# EAGLE design solderstation_v1_6 (EAGLE 6.6.0)
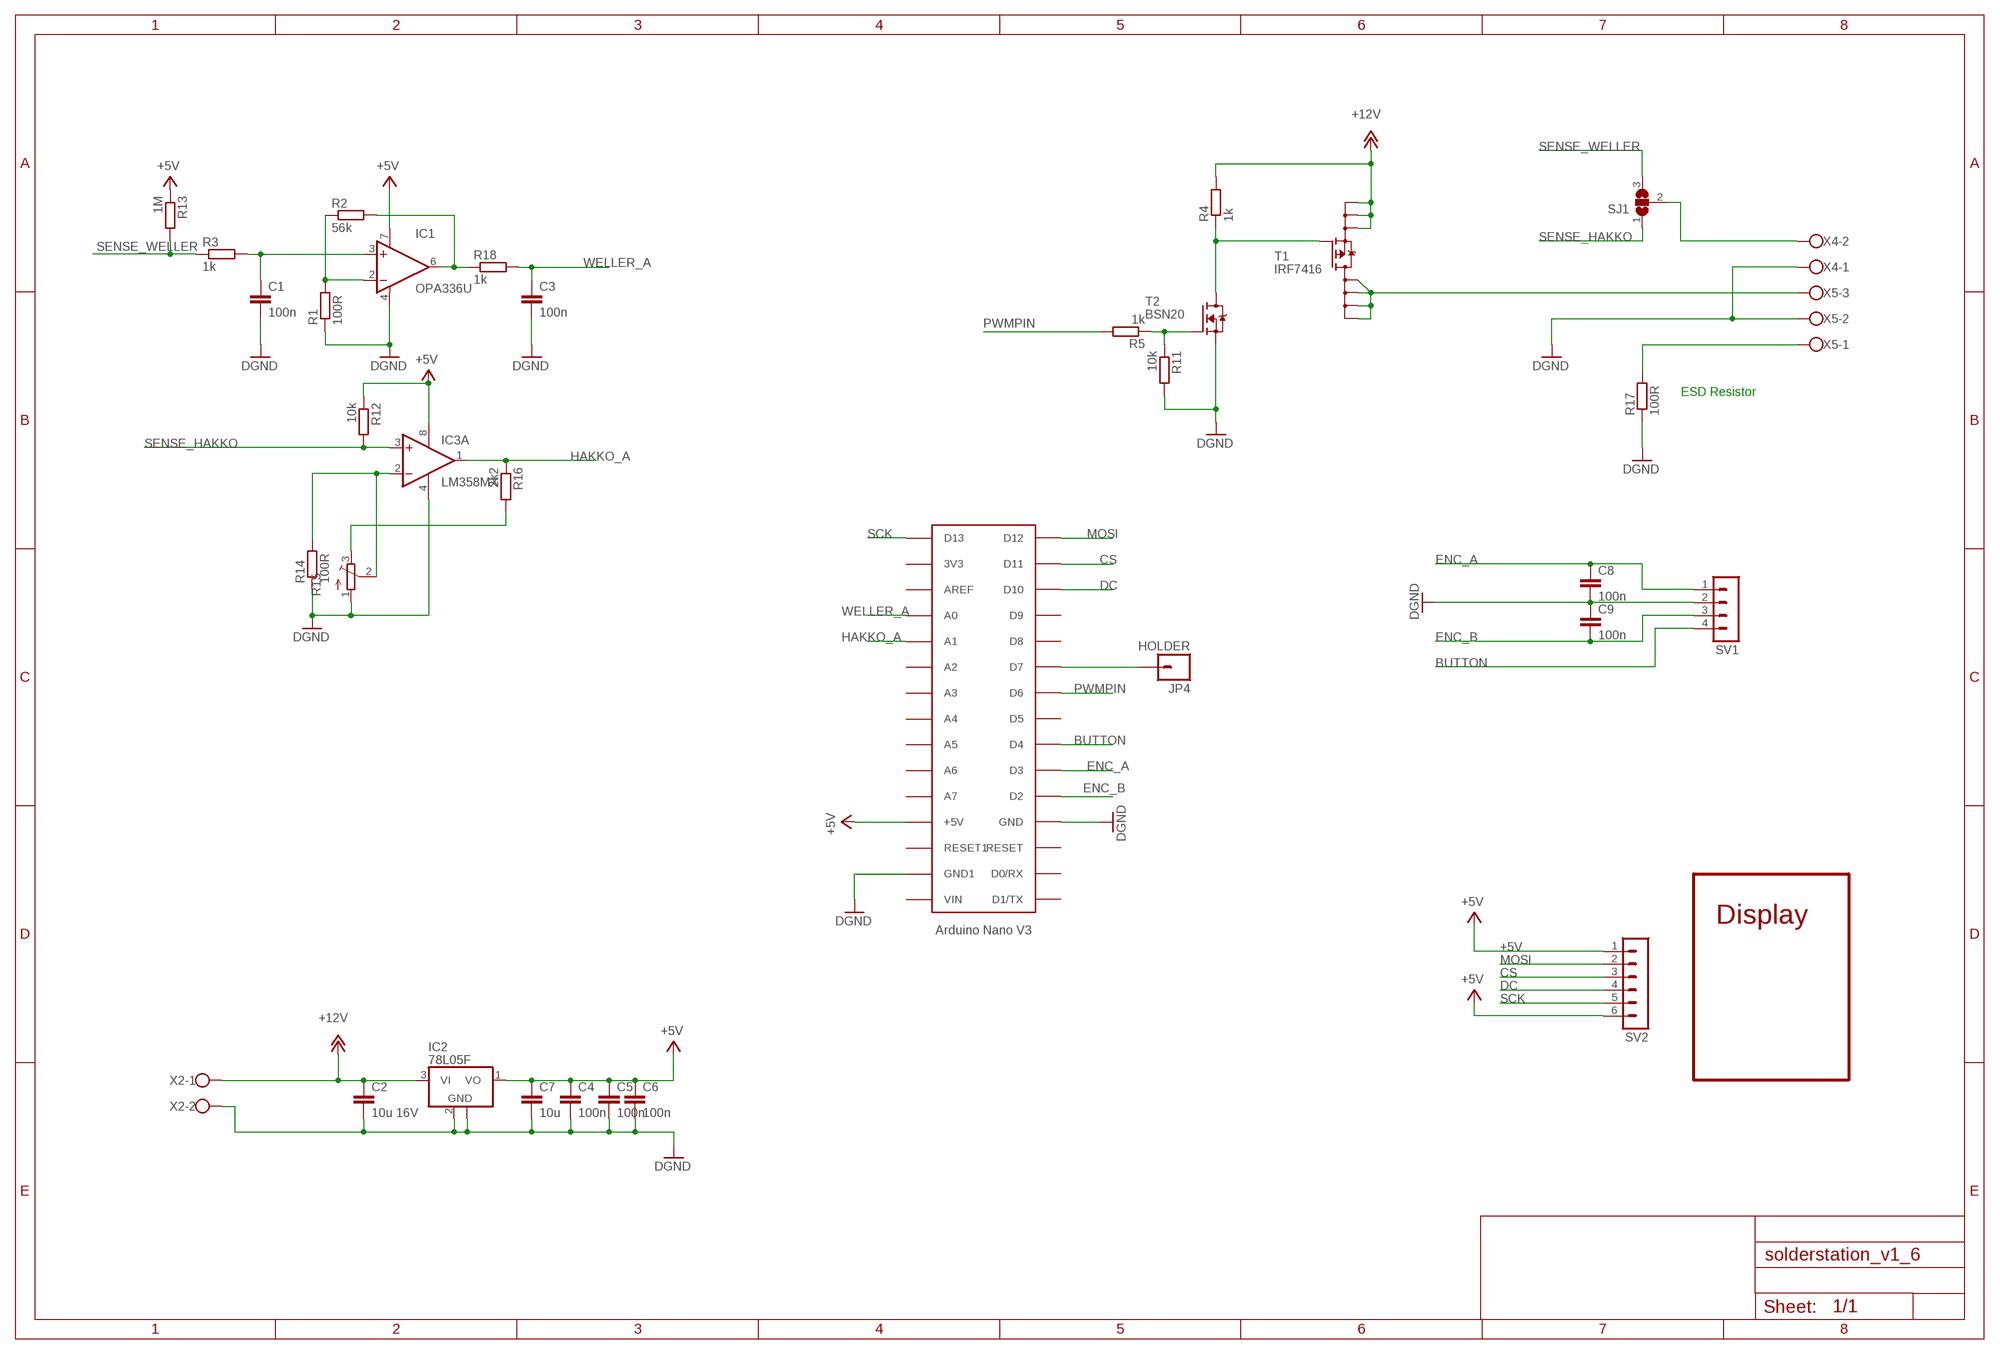
[diagram p0: schematic, sheet 1]

## Parts
C1  100n  C-EUC1206  [C1206]
C2  10u 16V  C-EUC1210K  [C1210K]
C3  100n  C-EUC1206  [C1206]
C4  100n  C-EUC1206  [C1206]
C5  100n  C-EUC1206  [C1206]
C6  100n  C-EUC1206  [C1206]
C7  10u  C-EUC1210K  [C1210K]
C8  100n  C-EUC1206  [C1206]
C9  100n  C-EUC1206  [C1206]
IC1  OPA336U  [SO08]
IC2  78L05F  [SOT89]
IC3  LM358MX  [SO08]
JP4  HOLDER  M01PTH  [1X01]
R1  100R  R-EU_R0603  [R0603]
R2  56k  R-EU_R0603  [R0603]
R3  1k  R-EU_R0603  [R0603]
R4  1k  R-EU_R0603  [R0603]
R5  1k  R-EU_R0603  [R0603]
R11  10k  R-EU_R0603  [R0603]
R12  10k  R-EU_R0603  [R0603]
R13  1M  R-EU_R0603  [R0603]
R14  100R  R-EU_R0603  [R0603]
R15  TRIM_EU-SM-42/43X  [SM-42/43X]
R16  2k2  R-EU_R0603  [R0603]
R17  100R  R-EU_R0603  [R0603]
R18  1k  R-EU_R0603  [R0603]
SJ1  SJ2W  [SJ_2]
SV1  MA04-1  [MA04-1]
SV2  MA06-1  [MA06-1]
T1  IRF7416  [SO8]
T2  BSN20  [SOT23]
U$6  ARDUINONANO  [PDIP-32]
X2  W237-102  [W237-102]
X4  W237-102  [W237-102]
X5  W237-103  [W237-103]

## Nets
+5V: C4.1 C5.1 C6.1 C7.1 IC1.7(V+) IC2.1(VO) IC3.8(P:V+) R12.1 R13.1 SV2.1 SV2.6 U$6.+5V
+12V: C2.1 IC2.3(VI) R4.2 T1.1(S0) T1.2(S1) T1.3(S2) X2.1
BUTTON: SV1.4 U$6.D4
CS: SV2.3 U$6.D11
DC: SV2.4 U$6.D10
DGND: C1.2 C2.2 C3.2 C4.2 C5.2 C6.2 C7.2 C8.2 C9.1 IC1.4(V-) IC2.2(GND) IC2.2@1(GND) IC3.4(P:V-) R1.1 R11.2 R14.1 R15.1(A) R17.1 SV1.2 T2.2(S) U$6.GND U$6.GND1 X2.2 X4.1 X5.2
ENC_A: C8.1 SV1.1 U$6.D3
ENC_B: C9.2 SV1.3 U$6.D2
HAKKO_A: IC3.1(A:OUT) R16.1 U$6.A6(A1)
HEATER: T1.5(D0) T1.6(D1) T1.7(D2) T1.8(D3) X5.3
MOSI: SV2.2 U$6.D12
N$1: IC1.2(-IN) R1.2 R2.1
N$2: IC1.6(OUT) R2.2 R18.1
N$3: R5.1 R11.1 T2.1(G)
N$4: C1.1 IC1.3(+IN) R3.2
N$5: R4.1 T1.4(G) T2.3(D)
N$12: SJ1.2 X4.2
N$14: R15.3(E) R16.2
N$15: IC3.2(A:-IN) R14.2 R15.2(S)
N$16: JP4.1 U$6.D7
N$17: R17.2 X5.1
PWMPIN: R5.2 U$6.D6
SCK: SV2.5 U$6.D13
SENSE_HAKKO: IC3.3(A:+IN) R12.2 SJ1.1
SENSE_WELLER: R3.1 R13.2 SJ1.3
WELLER_A: C3.1 R18.2 U$6.A7(A0)
Unconnected: IC3.5(B:+IN) IC3.6(B:-IN) IC3.7(B:OUT) U$6.3V3 U$6.A0(A7) U$6.A1(A6) U$6.A2(A5) U$6.A3(A4) U$6.A4(A3) U$6.A5(A2) U$6.AREF U$6.D0/RX U$6.D1/TX U$6.D5 U$6.D8 U$6.D9 U$6.RESET U$6.RESET1 U$6.VIN

## Notes on the sheet
- ESD Resistor
- Display

## Library data of the parts
C1-C9 = rcl:C-EU: CAPACITOR, European symbol
IC1 = burr-brown:OPA336: CMOS Operational Amplifiers Single-Supply, MicroPower, MicroAmplifier(TM) Series; MF: TEXAS INSTRUMENT CONNECTORS; MPN: OPA336UA; OC_FARNELL: 1459587; OC_NEWARK: 35C1888
IC2 = linear:78L*: POSITOIV-VOLTAGE REGULATORS Output up to 100 mA Source: http://focus.ti.com/lit/ds/symlink/ua78l05.pdf
IC3 = linear:LM358: OP AMP also LM158; LM258; LM2904 Source: http://cache.national.com/ds/LM/LM158.pdf
JP4 = SparkFun:M01: Header 1 Standard 1-pin 0.1" header. Use with straight break away headers (SKU : PRT-00116), right angle break away headers (PRT-00553), swiss pins (PRT-00743), machine pins (PRT-00117), and female headers (PRT-00115).
R1-R5 R11-R14 R16-R18 = rcl:R-EU_: RESISTOR, European symbol
R15 = pot:TRIM_EU-: POTENTIOMETER
SJ1 = jumper:SJ2W: SMD solder JUMPER
SV1 = con-lstb:MA04-1: PIN HEADER; OC_FARNELL: unknown; OC_NEWARK: unknown
SV2 = con-lstb:MA06-1: PIN HEADER; OC_FARNELL: unknown; OC_NEWARK: unknown
T1 = IRF74xx:IRF7416
T2 = bsn20:BSN20
U$6 = CRE-Lib1:ARDUINONANO: Arduino Nano
X2 X4 = con-wago-500:W237-102: WAGO SCREW CLAMP; MPN: 237-102; OC_FARNELL: unknown; OC_NEWARK: 70K9898
X5 = con-wago-500:W237-103: WAGO SCREW CLAMP; MPN: 237-103; OC_FARNELL: unknown; OC_NEWARK: 18M7116

## Board
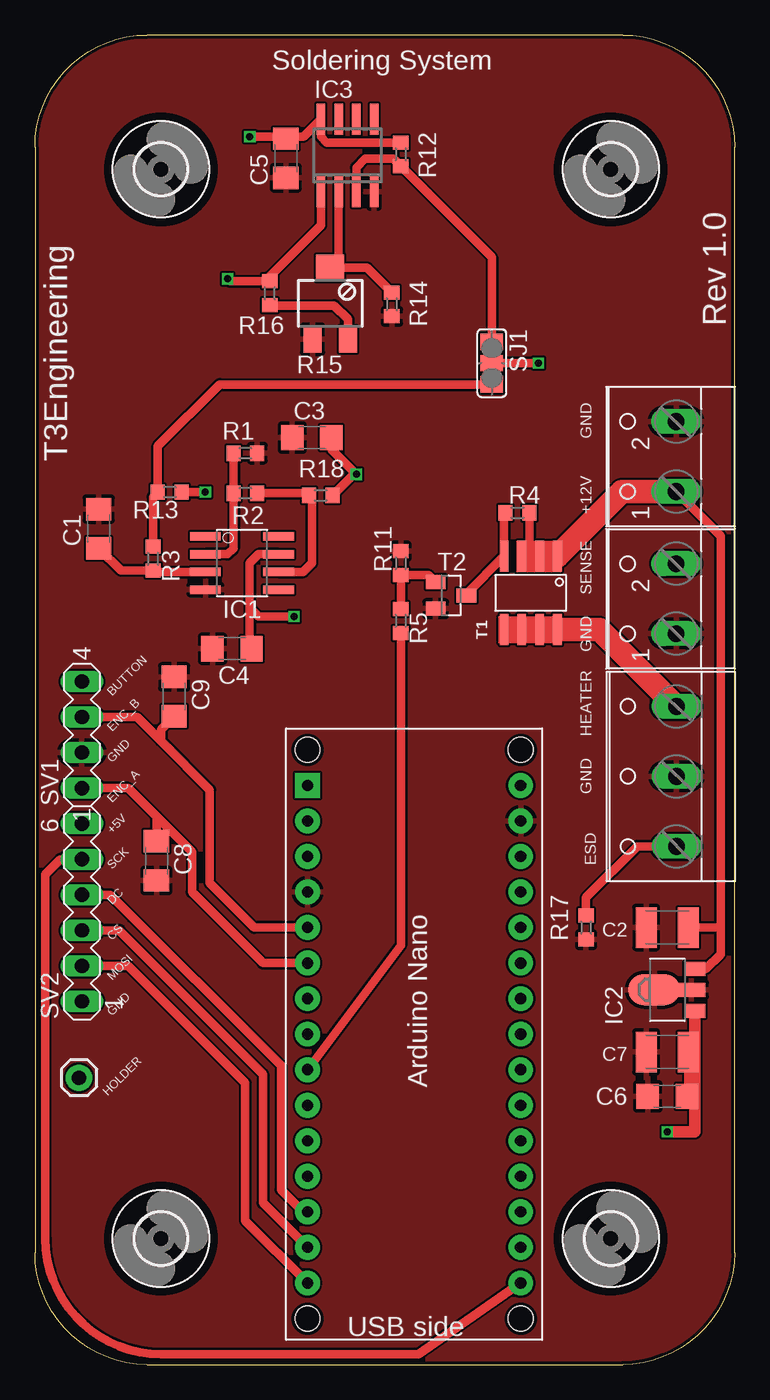
[diagram p1: board, top side]
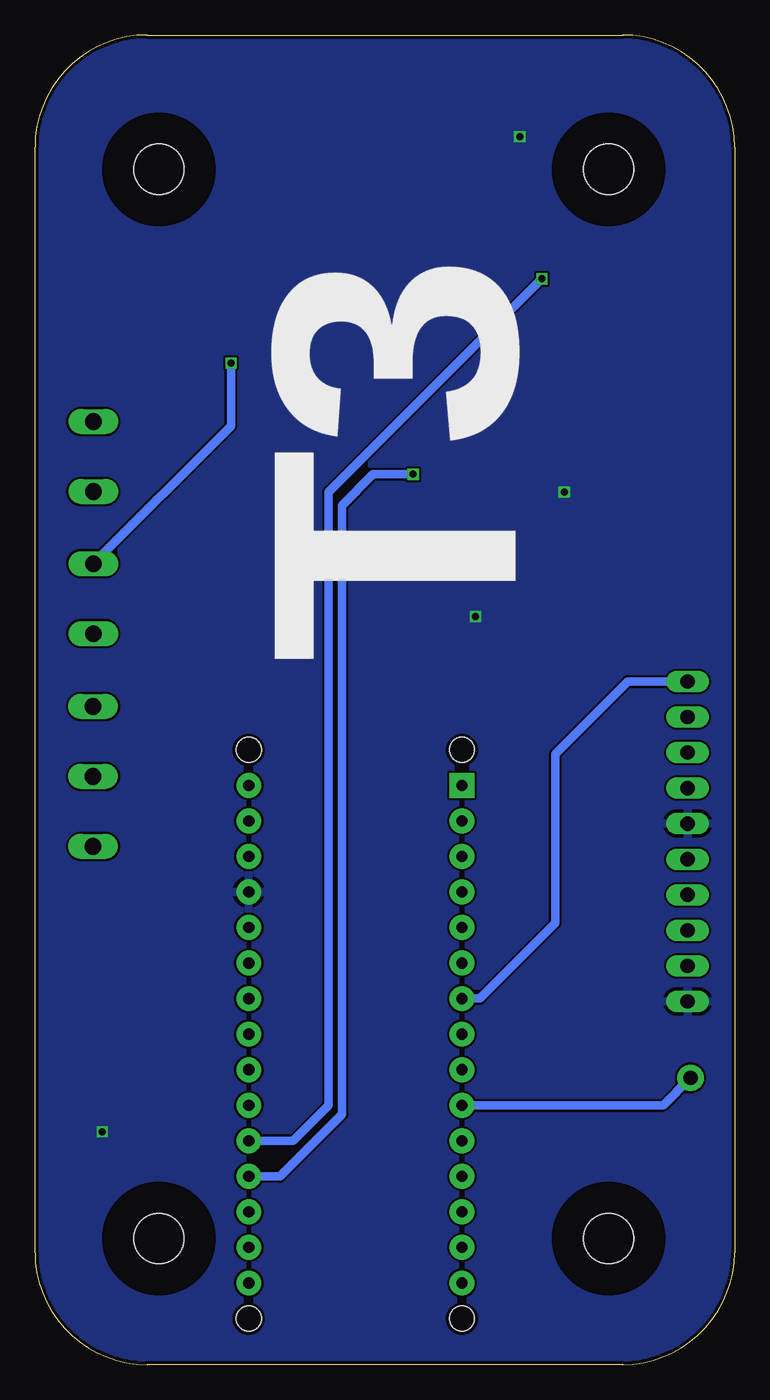
[diagram p2: board, bottom side, seen from below]

Size 50 x 95 mm. Coordinates in mm from the lower left corner, seen from the top.
Outline: 8,0 42,0 arc90 50,8 50,87 arc90 42,95 8,95 arc90 0,87 0,8 arc90 8,0
Copper layers (1*16): Top 0.035mm / dielectric 1.5mm / Bottom 0.035mm
Design rules "SeeedStudio_2layer_DRU_no_angle_20140221": minimum track width 6mil, minimum drill 12mil, track to track 6mil, track to pad 6mil, pad to pad 6mil, via to via 6mil, smd to smd 0mil, copper to edge 10mil, drill to drill 10mil, minimum pad ring 10mil, minimum via ring 6mil, stop-mask expansion 2mil, vias tented up to drill 100mil, thermal gap 10mil

### Footprints (pad centres in the part's own frame; a part is rotated, then mirrored left to right if it is on the bottom)
C1206 = smd 1.6 x 1.8: 1 -1.4,0; 2 1.4,0
C1210K = smd 1.5 x 2.9: 1 -1.5,0; 2 1.5,0
SO08 = smd 0.61 x 2.21: 1 -1.905,-2.616; 2 -0.635,-2.616; 3 0.635,-2.616; 4 1.905,-2.616; 5 1.905,2.616; 6 0.635,2.616; 7 -0.635,2.616; 8 -1.905,2.616
SOT89 = smd 1 x 1.5: 1 -1.499,-1.981; 3 1.499,-1.981 | smd 1 x 2: 2 0,-1.727 | smd 2.2 x 3.7: 2@1 0,0.94
SO08' = smd 0.6 x 2.2: 1 -1.905,-2.6; 2 -0.635,-2.6; 3 0.635,-2.6; 4 1.905,-2.6; 5 1.905,2.6; 6 0.635,2.6; 7 -0.635,2.6; 8 -1.905,2.6
1X01 = drill 1.016 pad 1.88: 1 0,0
R0603 = smd 1 x 1.1: 1 -0.85,0; 2 0.85,0
SM-42/43X = smd 1.3 x 1.9: 1 -1.27,-2.55; 3 1.27,-2.55 | smd 2 x 1.9: 2 0,2.55
SJ_2 = smd 1.168 x 1.6: 1 -1.524,0; 2 0,0; 3 1.524,0
MA04-1 = drill 1.016 long: 1 -3.81,0; 2 -1.27,0; 3 1.27,0; 4 3.81,0
MA06-1 = drill 1.016 long: 1 -6.35,0; 2 -3.81,0; 3 -1.27,0; 4 1.27,0; 5 3.81,0; 6 6.35,0
SO8 = smd 2.21 x 0.61: 1 2.616,-1.905; 2 2.616,-0.635; 3 2.616,0.635; 4 2.616,1.905; 5 -2.616,1.905; 6 -2.616,0.635; 7 -2.616,-0.635; 8 -2.616,-1.905
SOT23 = smd 1 x 1.4: 1 -0.95,-1.1; 2 0.95,-1.1; 3 0,1.1
3,6 = hole 3.6: 0,0
PDIP-32 = drill 0.8 pad 1.778: 3V3 15.24,-35.56; +5V 15.24,-10.16; A0 15.24,-12.7; A1 15.24,-15.24; A2 15.24,-17.78; A3 15.24,-20.32; A4 15.24,-22.86; A5 15.24,-25.4; A6 15.24,-27.94; A7 15.24,-30.48; AREF 15.24,-33.02; D0/RX 0,-5.08; D2 0,-12.7; D3 0,-15.24; D4 0,-17.78; D5 0,-20.32; D6 0,-22.86; D7 0,-25.4; D8 0,-27.94; D9 0,-30.48; D10 0,-33.02; D11 0,-35.56; D12 0,-38.1; D13 15.24,-38.1; GND 0,-10.16; GND1 15.24,-5.08; RESET 0,-7.62; RESET1 15.24,-7.62; VIN 15.24,-2.54 | drill 0.8 pad 1.778 square: D1/TX 0,-2.54 | hole 1.778: 0,0; 0,-40.64; 15.24,-40.64; 15.24,0
W237-102 = drill 1.194 long: 1 -2.5,-1.27; 2 2.5,-1.27
W237-103 = drill 1.194 long: 1 -5,-1.29; 2 0,-1.29; 3 5,-1.29

### Placement (x,y rotation side)
C1  4.56,59.72 90 top
C2  45.2,31.23 180 top
C3  19.79,66.23 180 top
C4  14.09,51.15 180 top
C5  17.93,86.19 270 top
C6  45.2,19.16 180 top
C7  45.2,22.34 180 top
C8  8.68,35.99 270 top
C9  9.95,47.73 270 top
IC1  14.79,57.27 270 top
IC2  45.2,26.78 90 top
IC3  LM358MX  [SO08']  22.34,86.39 0 top
JP4  3.15,20.48 0 top
R1  15.04,65.12 180 top
R2  15.04,62.26 0 top
R3  8.45,57.58 270 top
R4  34.48,60.85 0 top
R5  26.14,53.13 270 top
R11  26.14,57.26 90 top
R12  26.14,86.47 270 top
R13  9.63,62.34 180 top
R14  25.5,75.75 90 top
R15  21.11,75.81 0 top
R16  16.77,76.55 270 top
R17  39.39,31.23 90 top
R18  20.43,62.1 0 top
SJ1  32.65,71.56 270 top
SV1  3.35,44.99 90 top
SV2  3.35,32.3 90 top
T1  35.44,55.14 90 top
T2  29.74,54.95 270 top
U$1  [3,6]  9,9 0 top
U$2  [3,6]  41.15,9 0 top
U$4  [3,6]  9,85.4 0 top
U$5  [3,6]  41.15,85.4 0 top
U$6  19.48,43.92 0 top
X2  44.56,64.88 90 top
X4  44.56,54.72 90 top
X5  44.56,42.02 90 top

### Tracks (layer width: path | path; a pad name or v marks a point on that pad's centre or on a via)
+5V  (via drill 0.5)
  Top 0.61: IC2.1 47.18,22.82 C7.1 46.7,19.26 C6.1 | C5.1 18.42,87.74 | 18.42,87.74 v15.35,87.74 | 15.35,54.09 15.35,57.26 15.99,57.9 IC1.7 | 15.35,54.09 15.98,53.45 v18.52,53.45 | R12.1 20.85,87.32 20.43,87.74 IC3.8 19.18,87.74 18.42,87.74 | R13.1 v12.18,62.34 | 15.35,54.09 15.35,51.28 C4.1
  Top 0.813: IC2.1 47.18,16.62 v45.2,16.62
  pour Bottom: -4.33,97.27 54.72,97.27 54.72,-6.88 -4.33,-6.88
+12V
  Top 0: T1.3 35.35,57.76 T1.2 T1.1
  Top 0.61: IC2.3 47.96,28.28 49.01,29.32 49.01,31.23 | 49.01,31.23 49.01,59.2 X2.1 | C2.1 49.01,31.23 | R4.2 35.33,57.78 35.35,57.76
  Top 1.676: X2.1 41.96,62.38 T1.1
BUTTON
  Bottom 0.61: U$6.D4 18.21,26.14 12.81,31.54 12.81,43.61 7.61,48.8 SV1.4
CS
  Top 0.61: SV2.3 6.03,31.02 16.3,20.75 16.3,11.54 U$6.D11
DC
  Top 0.61: SV2.4 5.39,33.56 17.57,21.38 17.57,12.49 19.16,10.9 U$6.D10
DGND
  pour Top: -1.09,-0.9 -2.9,95.5 51.62,95.5 51.42,-1.1
ENC_A
  Top 0.61: SV1.1 6.66,41.19 8.68,39.16 | 8.68,39.16 11.22,36.62 11.22,33.77 16.3,28.68 U$6.D3 | C8.1 8.68,39.16
ENC_B
  Top 0.61: 9,44.56 12.49,41.07 12.49,34.4 15.67,31.23 U$6.D2 | 9,44.56 7.29,46.27 SV1.3 | C9.2 9,45.38 9,44.56
HAKKO_A  (via drill 0.5)
  Top 0.61: IC3.1 20.43,81.39 16.77,77.73 R16.1 13.95,77.4 v13.76,77.58
  Bottom 0.61: v13.76,77.58 29,62.34 29,18.52 31.54,15.98 U$6.A6
HEATER
  Top 0: T1.5 T1.6 T1.7 T1.8
  Top 1.676: T1.8 40.35,52.52 X5.3
MOSI
  Top 0.61: SV2.2 6.66,28.48 15.03,20.11 15.03,10.27 U$6.D12
N$1
  Top 0.61: IC1.2 13.76,57.9 14.19,58.32 R2.1 R1.2
N$2
  Top 0.61: IC1.6 19.16,56.63 19.8,57.26 19.8,61.88 R18.1 19.42,62.26 R2.2
N$3
  Top 0.61: R5.1 R11.1 28.14,56.41 T2.1
N$4
  Top 0.61: IC1.3 8.55,56.63 R3.2 6.15,56.73 C1.1
N$5
  Top 0.61: R4.1 33.53,60.75 T1.4 30.84,55.07 T2.3
N$12  (via drill 0.5)
  Top 0.61: v35.99,71.55 v35.98,71.56 SJ1.2
  Bottom 0.61: X4.2 35.99,67.06 v35.99,71.55
N$14
  Top 0.61: R16.2 16.8,75.67 21.38,75.67 22.38,74.68 R15.3
N$15
  Top 0.61: R14.2 23.75,78.36 R15.2 21.7,78.96 IC3.2
N$16
  Bottom 0.61: U$6.D7 5.11,18.52 JP4.1
N$17
  Top 0.61: X5.1 43.05,37.02 39.39,33.36 R17.2
PWMPIN
  Top 0.61: R5.2 26.14,29.95 U$6.D6
SCK
  Top 0.61: U$6.D13 27.41,0.74 9,0.74 arc-90 0.74,9 0.74,35.03 1.81,36.1 SV2.5
SENSE_HAKKO
  Top 0.61: SJ1.1 32.65,79.12 R12.2 25.61,86.15 23.61,86.15 22.98,85.52 IC3.3
SENSE_WELLER
  Top 0.61: R3.1 8.45,62 R13.2 8.79,65.62 13.2,70.03 SJ1.3
WELLER_A  (via drill 0.5)
  Top 0.61: v22.97,63.61 22.89,63.69 | 22.89,63.69 R18.2 | 22.89,63.69 21.19,65.39 C3.1
  Bottom 0.61: v22.97,63.61 25.83,63.61 28.05,61.39 28.05,17.89 32.49,13.45 U$6.A7
(copper drawn outside any net)
  shapes: Top area x2

### Text on the board
tNames: Soldering System | Rev 1.0 | GND | T3Engineering | +12V | SENSE | GND | BUTTON | ENC_B | HEATER | GND | GND | ENC_A | +5V | ESD | SCK | DC | CS | MOSI | GND | Arduino Nano | HOLDER | USB side
bNames: T3